# EAGLE board eTapper1main31 (EAGLE 8.3.2)
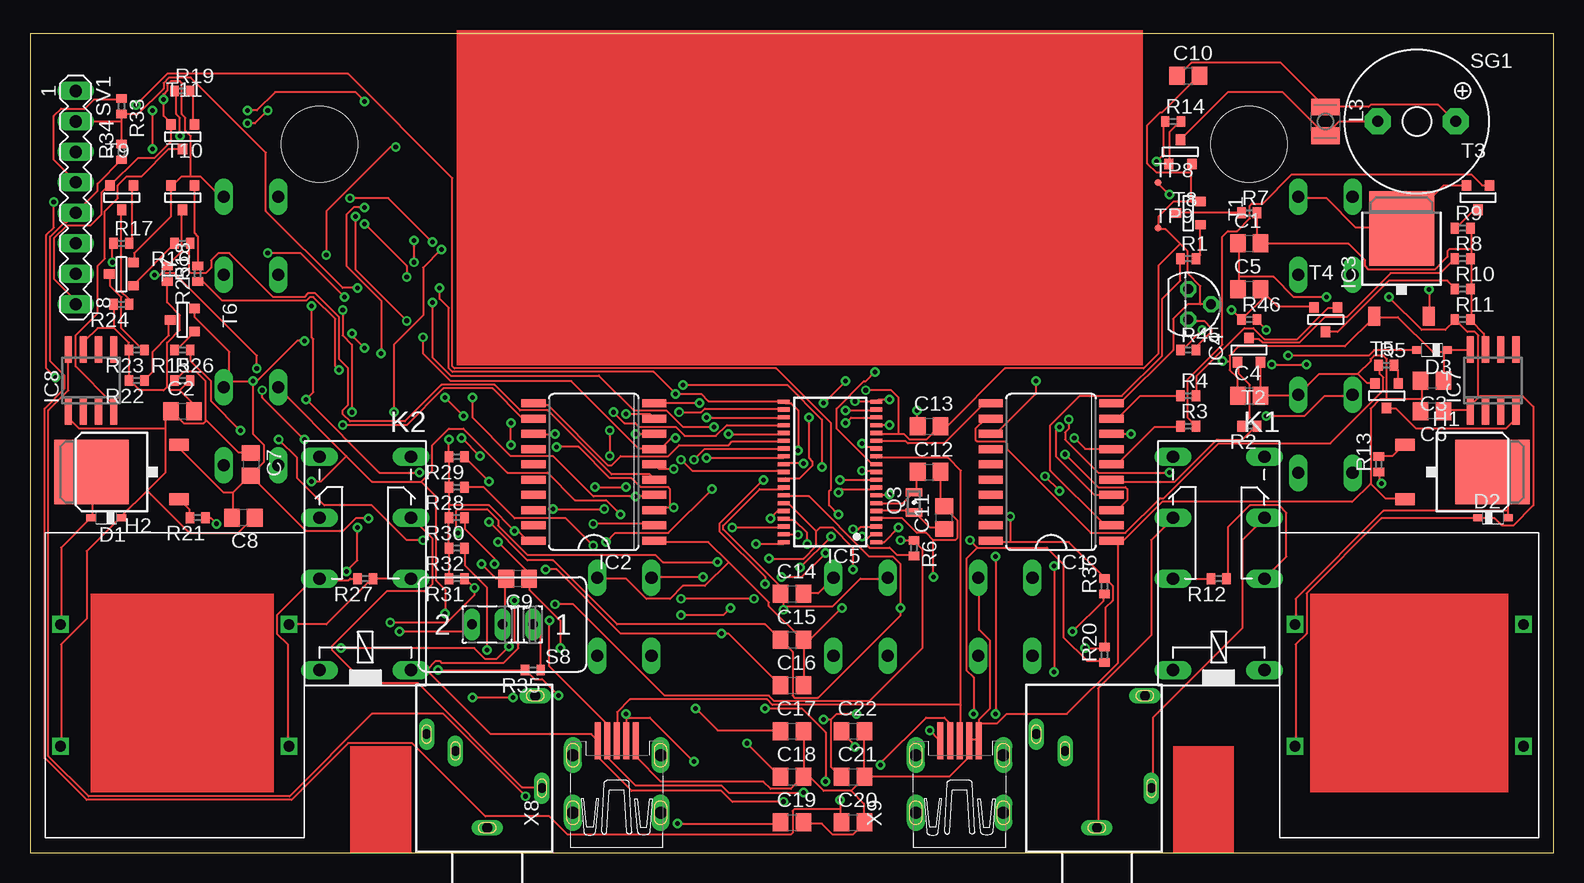
[diagram p1: board, top side]
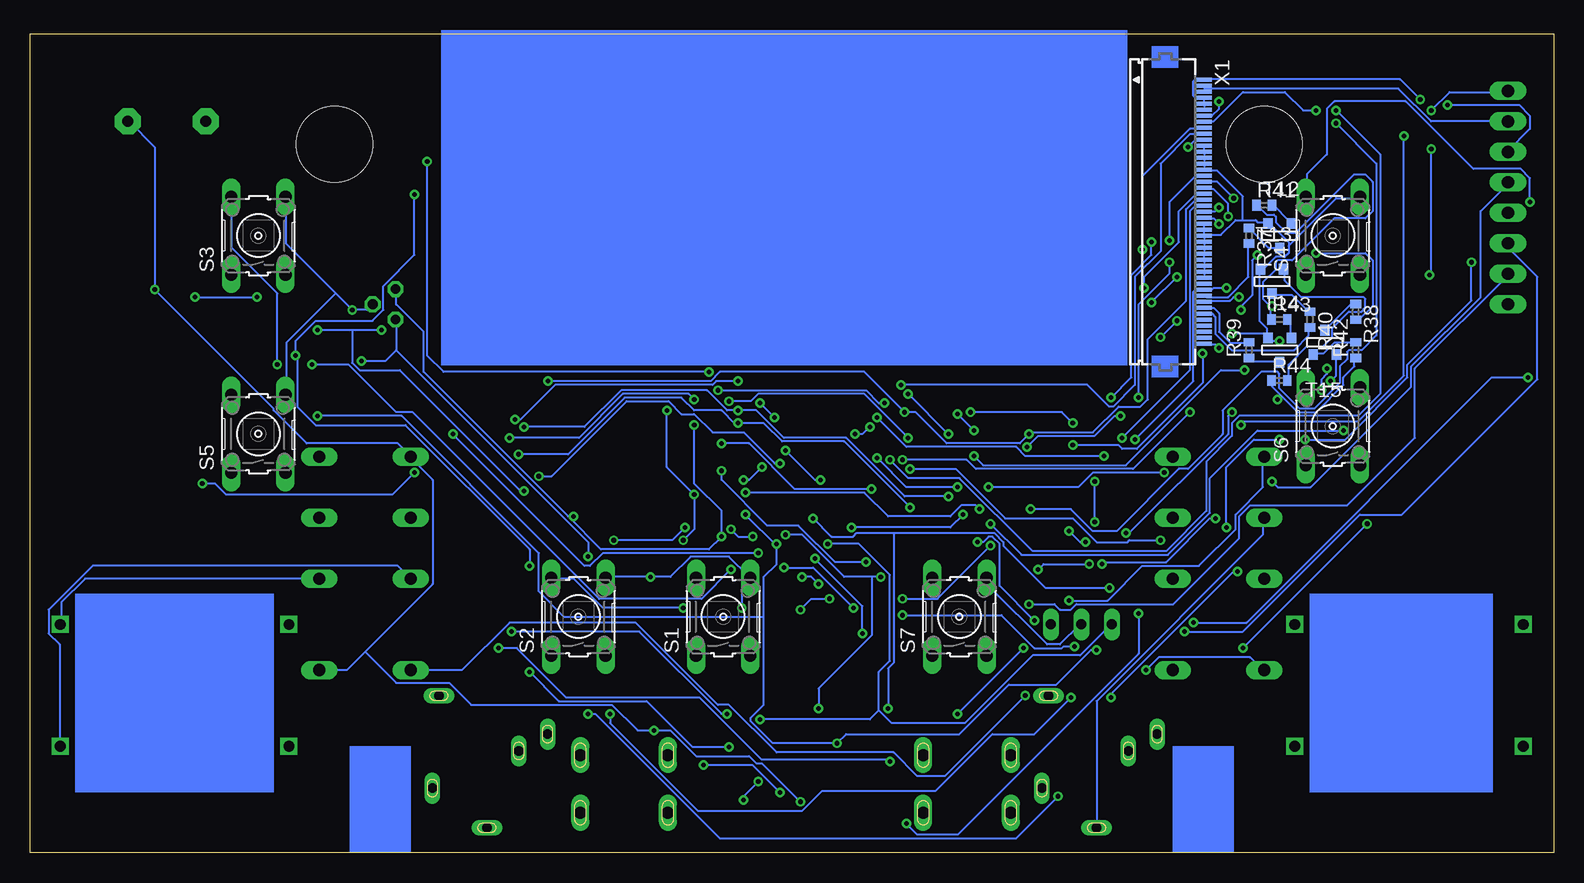
[diagram p2: board, bottom side, seen from below]

Size 126.98 x 68.25 mm. Coordinates in mm from the lower left corner, seen from the top.
Outline: 0,0 126.98,0 126.98,68.25 0,68.25 0,0
Copper layers (1*16): Top 0.035mm / dielectric 1.5mm / Bottom 0.035mm
Design rules "default *": minimum track width 6mil, minimum drill 15mil, track to track 6mil, track to pad 6mil, pad to pad 6mil, via to via 6mil, smd to smd 6mil, copper to edge 40mil, drill to drill 6mil, minimum pad ring 10mil, minimum via ring 8mil, stop-mask expansion 4mil, vias tented up to drill 0mil, thermal gap 10mil
Holes 6.35 mm at 24.13,59.05 101.6,59.05

## Footprints (pad centres in the part's own frame; a part is rotated, then mirrored left to right if it is on the bottom)
C0805 = smd 1.3 x 1.5: 1 -0.95,0; 2 0.95,0
SOD323_ST = smd 0.8 x 0.6: A 1.25,0; C -1.25,0
XFMR = drill 0.889 square: P$1 -10.16,5.08; P$2 -10.16,-5.08; P$3 8.89,5.08; P$4 8.89,-5.08
D-PAK_TO252AA = smd 1 x 1.6: 1 -2.28,-4.8; 3 2.28,-4.8 | smd 5.4 x 6.2: 4 0,2.5
SO20W = smd 0.66 x 2.032: 1 -5.715,-5.029; 2 -4.445,-5.029; 3 -3.175,-5.029; 4 -1.905,-5.029; 5 -0.635,-5.029; 6 0.635,-5.029; 7 1.905,-5.029; 8 3.175,-5.029; 9 4.445,-5.029; 10 5.715,-5.029; 11 5.715,5.029; 12 4.445,5.029; 13 3.175,5.029; 14 1.905,5.029; 15 0.635,5.029; 16 -0.635,5.029; 17 -1.905,5.029; 18 -3.175,5.029; 19 -4.445,5.029; 20 -5.715,5.029
TO252 = smd 1 x 1.6: 1 -2.28,-4.8; 3 2.28,-4.8 | smd 5.4 x 6.2: 2 0,2.5
TO92 = drill 0.813 pad 1.27 octagon: 1 -1.27,0; 2 0,1.905; 3 1.27,0
TSSOP38_R-PDSO-G38-DA = smd 0.35 x 1: 1 -5.85,-3.85; 2 -5.2,-3.85; 3 -4.55,-3.85; 4 -3.9,-3.85; 5 -3.25,-3.85; 6 -2.6,-3.85; 7 -1.95,-3.85; 8 -1.3,-3.85; 9 -0.65,-3.85; 10 0,-3.85; 11 0.65,-3.85; 12 1.3,-3.85; 13 1.95,-3.85; 14 2.6,-3.85; 15 3.25,-3.85; 16 3.9,-3.85; 17 4.55,-3.85; 18 5.2,-3.85; 19 5.85,-3.85; 20 5.85,3.85; 21 5.2,3.85; 22 4.55,3.85; 23 3.9,3.85; 24 3.25,3.85; 25 2.6,3.85; 26 1.95,3.85; 27 1.3,3.85; 28 0.65,3.85; 29 0,3.85; 30 -0.65,3.85; 31 -1.3,3.85; 32 -1.95,3.85; 33 -2.6,3.85; 34 -3.25,3.85; 35 -3.9,3.85; 36 -4.55,3.85; 37 -5.2,3.85; 38 -5.85,3.85
SO08 = smd 0.6 x 2.2: 1 -1.905,-2.6; 2 -0.635,-2.6; 3 0.635,-2.6; 4 1.905,-2.6; 5 1.905,2.6; 6 0.635,2.6; 7 -0.635,2.6; 8 -1.905,2.6
351 = drill 1.016 long: 1 -3.81,-3.81; 16 -3.81,3.81; O1 8.89,-3.81; O2 8.89,3.81; P1 3.81,-3.81; P2 3.81,3.81; S1 13.97,-3.81; S2 13.97,3.81
L2825P = smd 1.4 x 2.4: 1 -1.2,0; 2 1.2,0
FC-12M = smd 0.7 x 1.4: 1 -0.85,0; 2 0.85,0
R0402 = smd 0.7 x 0.9: 1 -0.65,0; 2 0.65,0
B3F-10XX = drill 1.016 long: 1 -3.251,2.261; 2 3.251,2.261; 3 -3.251,-2.261; 4 3.251,-2.261
M251 = drill 0.813 long: 1 -2.54,0; 2 0,0; 3 2.54,0
F/QMBIII = drill 0.914 pad 2.159 octagon: + 3.251,0; - -3.251,0
MA08-1 = drill 1.016 long: 1 -8.89,0; 2 -6.35,0; 3 -3.81,0; 4 -1.27,0; 5 1.27,0; 6 3.81,0; 7 6.35,0; 8 8.89,0
SOT-23 = smd 0.787 x 0.889: 1 0.025,-1.016; 2 -0.94,1.016; 3 0.991,1.016
TP06R = smd 0.6 x 0.6: TP 0,0
FH12-45S-0.5SH = smd 0.3 x 1.3: 1 -13,3.25; 2 -12.5,3.25; 3 -12,3.25; 4 -11.5,3.25; 5 -11,3.25; 6 -10.5,3.25; 7 -10,3.25; 8 -9.5,3.25; 9 -9,3.25; 10 -8.5,3.25; 11 -8,3.25; 12 -7.5,3.25; 13 -7,3.25; 14 -6.5,3.25; 15 -6,3.25; 16 -5.5,3.25; 17 -5,3.25; 18 -4.5,3.25; 19 -4,3.25; 20 -3.5,3.25; 21 -3,3.25; 22 -2.5,3.25; 23 -2,3.25; 24 -1.5,3.25; 25 -1,3.25; 26 -0.5,3.25; 27 0,3.25; 28 0.5,3.25; 29 1,3.25; 30 1.5,3.25; 31 2,3.25; 32 2.5,3.25; 33 3,3.25; 34 3.5,3.25; 35 4,3.25; 36 4.5,3.25; 37 5,3.25; 38 5.5,3.25; 39 6,3.25; 40 6.5,3.25; 41 7,3.25; 42 7.5,3.25; 43 8,3.25; 44 8.5,3.25; 45 9,3.25
1503_09 = drill 0.8 pad 1.2 long: 1 0,-2.1; 2 -4.55,-5.4; 3 5.05,-9.9; 4 -4,-13.1; 5 2.65,-8.5
32005-501 = smd 3.1 x 0.5: 1 3,1.6; 2 3,0.8; 3 3,0; 4 3,-0.8; 5 3,-1.6 | drill 1 pad 1.422 long: M1 -3,3.65; M2 -3,-3.65; M3 1.8,3.65; M4 1.8,-3.65

## Placement (x,y rotation side)
C1  .01uF  [C0805]  101.6,50.8 0 top
C2  .01uF  [C0805]  12.7,36.83 0 top
C3  [C0805]  116.84,39.37 180 top
C4  [C0805]  101.6,38.1 0 top
C5  3.3uF  [C0805]  101.6,46.99 0 top
C6  220uF  [C0805]  116.84,36.83 180 top
C7  220uF  [C0805]  18.41,32.38 270 top
C8  3.3uF  [C0805]  17.78,27.94 180 top
C9  47uF  [C0805]  40.64,22.86 180 top
C10  47uF  [C0805]  96.52,64.77 0 top
C11  12pF  [C0805]  76.2,27.94 90 top
C12  12pF  [C0805]  74.93,31.75 0 top
C13  1 uF  [C0805]  74.93,35.56 0 top
C14  .1uF  [C0805]  63.5,21.59 0 top
C15  .1uF  [C0805]  63.5,17.78 0 top
C16  .1uF  [C0805]  63.5,13.97 0 top
C17  .1uF  [C0805]  63.5,10.16 0 top
C18  .1uF  [C0805]  63.5,6.35 0 top
C19  .1uF  [C0805]  63.5,2.54 0 top
C20  .1uF  [C0805]  68.58,2.54 0 top
C21  .1uF  [C0805]  68.58,6.35 0 top
C22  220uF  [C0805]  68.58,10.16 0 top
D1  BAT60J  [SOD323_ST]  6.35,27.94 180 top
D2  BAT60J  [SOD323_ST]  121.92,27.94 0 top
D3  BAT60J  [SOD323_ST]  116.84,41.91 180 top
F1  XFMR  [XFMR]  115.57,13.97 0 top
F2  XFMR  [XFMR]  12.7,13.97 0 top
H1  IRLR024N  [D-PAK_TO252AA]  119.38,31.75 270 top
H2  IRLR024N  [D-PAK_TO252AA]  7.62,31.75 90 top
IC1  74AC373DW  [SO20W]  85.09,31.75 90 top
IC2  74AC373DW  [SO20W]  46.99,31.75 90 top
IC3  LM2936DT-5.0  [TO252]  114.3,49.53 0 top
IC4  LM2936Z-3.0  [TO92]  96.52,45.72 270 top
IC5  MSP430F2232IDA  [TSSOP38_R-PDSO-G38-DA]  66.67,31.75 90 top
IC7  LP2951M  [SO08]  121.92,39.37 0 top
IC8  LP2951M  [SO08]  5.08,39.37 0 top
K1  351  [351]  99.06,19.05 90 top
K2  351  [351]  27.94,19.05 90 top
L3  470uH  [L2825P]  107.95,60.96 270 top
Q3  FC-12M  [FC-12M]  73.66,29.21 90 top
R1  47K  [R0402]  96.52,49.53 0 top
R2  47K  [R0402]  101.6,35.56 180 top
R3  47K  [R0402]  96.52,35.56 0 top
R4  47K  [R0402]  96.52,38.1 0 top
R5  47K  [R0402]  113.03,40.64 0 top
R6  47K  [R0402]  73.66,25.4 270 top
R7  1K  [R0402]  101.6,53.34 0 top
R8  3K  [R0402]  119.38,49.53 0 top
R9  6K  [R0402]  119.38,52.07 0 top
R10  12K  [R0402]  119.38,46.99 0 top
R11  3K  [R0402]  119.38,44.45 0 top
R12  51K  [R0402]  99.06,22.86 180 top
R13  1K  [R0402]  112.39,32.38 90 top
R14  1K  [R0402]  95.25,60.96 0 top
R15  47K  [R0402]  12.7,41.91 180 top
R16  47K  [R0402]  12.7,50.8 180 top
R17  47K  [R0402]  7.62,50.8 0 top
R18  47K  [R0402]  13.97,48.26 90 top
R19  47K  [R0402]  12.7,63.5 0 top
R20  47K  [R0402]  89.53,16.51 90 top
R21  1K  [R0402]  13.97,27.94 180 top
R22  1K  [R0402]  8.89,39.37 180 top
R23  3K  [R0402]  8.89,41.91 180 top
R24  6K  [R0402]  7.62,45.72 180 top
R25  12K  [R0402]  11.43,48.26 270 top
R26  3K  [R0402]  12.7,39.37 0 top
R27  51K  [R0402]  27.94,22.86 180 top
R28  47K  [R0402]  35.56,30.48 180 top
R29  47K  [R0402]  35.56,33.02 180 top
R30  47K  [R0402]  35.56,27.94 180 top
R31  47K  [R0402]  35.56,22.86 180 top
R32  47K  [R0402]  35.56,25.4 180 top
R33  47K  [R0402]  7.62,62.23 270 top
R34  47K  [R0402]  7.62,58.42 90 top
R35  100  [R0402]  41.91,15.24 180 top
R36  47K  [R0402]  89.53,22.23 90 top
R37  100  [R0402]  25.4,51.44 270 bottom
R38  100  [R0402]  16.51,45.09 270 bottom
R39  100  [R0402]  25.4,41.91 90 bottom
R40  100  [R0402]  20.32,44.45 270 bottom
R41  47K  [R0402]  24.13,53.98 0 bottom
R42  47K  [R0402]  16.51,41.91 90 bottom
R43  47K  [R0402]  22.86,44.45 0 bottom
R44  47K  [R0402]  22.86,39.37 0 bottom
R45  47K  [R0402]  96.52,41.91 0 top
R46  10K  [R0402]  101.6,44.45 0 top
S1  [B3F-10XX]  69.22,19.68 90 bottom
S2  [B3F-10XX]  81.28,19.68 90 bottom
S3  [B3F-10XX]  107.95,51.44 90 bottom
S4  [B3F-10XX]  18.41,51.44 90 bottom
S5  [B3F-10XX]  107.95,34.92 90 bottom
S6  [B3F-10XX]  18.41,35.56 90 bottom
S7  [B3F-10XX]  49.53,19.68 90 bottom
S8  [M251]  39.37,19.05 180 top
SG1  F/QMBIII  [F/QMBIII]  115.57,60.96 0 top
SV1  [MA08-1]  3.81,54.61 270 top
T1  2N3904  [SOT-23]  96.52,53.34 270 top
T2  2N3904  [SOT-23]  101.6,41.91 180 top
T3  2N3904  [SOT-23]  120.65,54.61 0 top
T4  2N3904  [SOT-23]  107.95,44.45 0 top
T5  2N3904  [SOT-23]  113.03,38.1 0 top
T6  2N3904  [SOT-23]  12.7,44.45 270 top
T7  2N3904  [SOT-23]  7.62,48.26 270 top
T8  2N3904  [SOT-23]  95.89,58.42 180 top
T9  2N3904  [SOT-23]  7.62,54.61 0 top
T10  2N3904  [SOT-23]  12.7,54.61 0 top
T11  2N3904  [SOT-23]  12.7,59.69 0 top
T12  2N3904  [SOT-23]  22.86,51.44 0 bottom
T13  2N3904  [SOT-23]  23.5,47.62 0 bottom
T14  2N3904  [SOT-23]  22.86,41.91 0 bottom
T15  2N3904  [SOT-23]  19.05,42.55 180 bottom
TP8  TPSTP06R  [TP06R]  93.98,55.88 0 top
TP9  TPSTP06R  [TP06R]  93.98,52.07 0 top
X1  FH12-45S-0.5SH  [FH12-45S-0.5SH]  32.38,51.44 270 bottom
X6  1503_09  [1503_09]  88.9,0 180 top
X7  1503_09  [1503_09]  38.1,0 180 top
X8  MINI-USB_SHIELD5P4-32005-501  [32005-501]  48.9,6.35 90 top
X9  MINI-USB_SHIELD5P4-32005-501  [32005-501]  77.47,6.35 90 top

## Tracks (layer width: path | path; a pad name or v marks a point on that pad's centre or on a via)
+3V  (via drill 0.38)
  Top 0.152: 81.69,25.91 86.56,25.91 89.46,23.01 R36.2 89.61,22.86 90.22,22.25 90.22,21.03 89.61,20.42 89.61,17.22 R20.2 89.46,17.07 v87.94,17.07 | 81.69,25.91 80.16,25.91 IC1.20 | 69.65,26.06 69.65,25.76 69.95,25.45 71.63,25.45 72.24,24.84 73.61,24.84 R6.2 | 69.65,26.06 70.1,26.52 70.41,26.52 IC5.2 | v71.63,35.66 70.56,35.66 IC5.16 | 69.65,26.06 v69.34,26.36 | v81.69,28.04 81.69,25.91 | R33.2 7.62,60.96 | 7.62,60.96 R34.2 | SV1.2 7.62,60.96 | R31.2 34.9,25.3 R32.2 34.9,25.45 34.9,27.89 R30.2 34.9,28.04 34.9,28.96 | R28.2 34.9,32.92 R29.2 34.9,33.07 v34.9,34.44 | R28.2 34.9,28.96 | R28.2 | v39.01,25.91 41.45,23.47 41.45,22.86 C9.1 41.6,22.86 41.6,21.95 44.2,19.36 v44.2,17.07 | IC2.20 41.91,26.06 41.45,26.06 40.69,26.82 v40.39,26.82 38.25,28.96 34.9,28.96 | 49.68,11.28 49.68,9.45 X8.4 | R33.2 8.99,61.57 11.12,63.7 11.12,64.16 11.58,64.62 13.41,64.62 19.66,58.37 19.66,53.49 26.06,47.09 v27.28,47.09 | R33.2 | v55.32,7.62 51.66,11.28 49.68,11.28 | 49.68,11.28 v49.68,11.58
  Bottom 0.152: v71.63,35.66 71.63,30.79 69.34,28.5 v69.34,26.36 70.41,25.3 79.4,25.3 82.14,28.04 | 82.14,28.04 94.18,40.08 94.18,43.43 96.47,45.72 96.47,46.94 IC4.1 | 82.14,28.04 v81.69,28.04 | 29.11,63.7 29.11,63.86 X1.2 | 29.11,63.7 29.11,63.55 X1.3 | 29.11,63.7 12.95,63.7 10.21,60.96 SV1.2 | v34.9,34.44 30.02,39.32 30.02,46.79 29.87,46.94 29.26,46.94 X1.36 29.11,46.94 28.5,46.94 28.35,47.09 v27.28,47.09 | v39.01,25.91 39.47,25.91 v40.39,26.82 | v44.2,17.07 v49.68,11.58 | v87.94,17.07 86.41,17.07 82.3,12.95 71.17,12.95 65.99,7.77 55.47,7.77 v55.32,7.62
+9V  (via drill 0.38)
  Top 0.152: D3.C 119.94,41.91 IC7.8 | 117.81,41.76 117.81,39.47 C3.1 | 117.81,41.76 117.96,41.91 D3.C | 99.97,41 99.97,41.45 100.74,42.22 109.58,42.22 112.01,44.65 IC3.1 112.17,44.65 114,44.65 116.89,41.76 117.81,41.76 | 99.97,41 99.97,40.23 100.58,39.62 100.58,38.1 C4.1 | 117.81,41.76 D3.C | R45.2 97.23,41.91 97.23,42.22 98.45,43.43 98.45,43.74 97.84,44.35 96.62,44.35 IC4.3 | v41.3,4.72 34.44,11.58 28.5,11.58 21.64,4.72 4.88,4.72 1.52,8.08 1.52,36.88 3.2,38.56 3.2,41.91 IC8.8 | v80.47,24.69 v80.47,11.58 | v99.36,41 99.97,41
  Bottom 0.152: v41.3,4.72 44.81,1.22 69.49,1.22 79.86,11.58 v80.47,11.58 | v80.47,24.69 80.47,25.91 96.47,41.91 | 96.47,41.91 96.47,44.35 IC4.3 | v99.36,41 97.38,41 96.47,41.91
/LCS  (via drill 0.38)
  Top 0.152: v67.36,30.02 67.67,30.33 70.41,30.33 IC5.8 | v43.59,28.65 v47.85,28.65 | v18.14,60.81 18.75,60.81 v19.81,61.87
  Bottom 0.152: v67.36,30.02 57.45,30.02 55.47,28.04 50.29,28.04 49.38,28.96 48.16,28.96 v47.85,28.65 | v43.59,28.65 40.23,28.65 38.41,26.82 36.42,26.82 31.24,32 30.48,32 27.58,34.9 27.58,36.88 24.38,40.08 23.01,40.08 22.86,39.93 22.86,38.71 21.18,37.03 19.96,37.03 17.83,39.17 17.83,40.54 17.22,41.15 17.22,41.76 17.07,41.91 16,41.91 14.78,43.13 14.78,57.45 v18.14,60.81 | v19.81,61.87 20.88,61.87 22.4,63.4 25.91,63.4 28.35,60.96 29.11,60.96 X1.8
/RST  (via drill 0.38)
  Top 0.152: v72.54,26.06 73.61,26.06 R6.1 73.76,25.91 74.37,25.3 74.37,17.07 69.95,12.65 62.03,12.65 61.57,13.11 52.88,13.11 45.26,20.73 v43.74,20.73 | v71.63,29.87 70.56,29.87 IC5.7 | v73.91,36.88 73.91,35.66 C13.1
  Bottom 0.152: v72.54,26.06 71.63,26.98 v71.63,29.87 73.91,32.16 v73.91,36.88 | v43.74,20.73 41.6,20.73 41.15,20.27 40.23,20.27 39.78,20.73 31.7,20.73 26.21,26.21 26.21,28.04 25.3,28.96 17.22,28.96 11.58,34.59 11.58,40.39 3.81,48.16 SV1.7
BAT+  (via drill 0.38)
  Top 0.152: v94.94,54.86 94.03,55.78 TP8.TP | v104.85,41.45 111.56,41.45 112.01,41.91 D3.A | v68.73,8.84 68.73,8.99 67.67,10.06 C22.1 | v85.34,23.93 v85.34,15.09
  Bottom 0.152: v94.94,54.86 94.94,49.84 97.54,47.24 97.54,45.26 98.45,44.35 103.17,44.35 104.85,42.67 v104.85,41.45 104.7,41.3 104.7,37.19 103.17,35.66 95.71,35.66 85.34,25.3 v85.34,23.93 | v68.73,8.84 71.78,8.84 75.59,12.65 82.91,12.65 v85.34,15.09
GND  (via drill 0.38)
  Top 0.152: 102.56,38.1 102.56,40.84 T2.2 | 110.64,39.93 111.4,39.17 112.01,39.17 T5.2 | 110.64,39.93 107.44,39.93 S5.4 105.61,38.1 102.56,38.1 | 102.56,38.1 C4.2 | 115.98,37.8 115.98,39.32 C3.2 | 115.98,37.8 115.98,36.88 C6.2 | 111.71,30.79 112.93,29.57 114.45,29.57 H1.3 | 111.71,30.79 111.71,37.03 112.47,37.8 113.08,37.8 | 115.98,37.8 113.08,37.8 | 90.68,26.06 91.14,26.06 94.34,29.26 110.19,29.26 111.71,30.79 | 90.68,26.06 90.22,26.06 IC1.1 90.68,26.06 | 110.64,39.93 111.71,41 111.71,41.15 112.01,41.45 112.78,41.45 113.08,41.15 113.08,37.8 | 72.39,34.9 72.85,34.9 73.3,34.44 74.68,34.44 75.74,35.51 C13.2 75.89,35.66 76.5,35.66 81.23,40.39 92.81,40.39 94.03,41.6 94.03,48.92 95.86,50.75 | 72.39,34.9 70.56,34.9 IC5.15 | v55.78,37.49 52.12,37.49 IC2.10 | v69.65,38.56 71.78,38.56 72.39,37.95 72.39,34.9 | T3.2 117.81,55.63 114.3,52.12 | 114.3,52.12 110.49,52.12 108.05,54.56 105.77,54.56 S3.4 | 114.3,52.12 IC3.2 | 96.77,54.25 97.54,54.25 T1.2 | 96.77,54.25 95.25,54.25 94.03,53.03 94.03,52.12 TP9.TP 94.03,51.97 94.64,51.97 95.86,50.75 | 96.77,54.25 96.77,56.69 | 96.77,56.69 96.77,57.3 T8.2 | 96.77,56.69 93.88,56.69 93.12,57.45 93.12,60.66 94.18,61.72 94.34,61.72 97.38,64.77 C10.2 | 103.02,46.48 102.56,46.94 C5.2 103.02,46.48 | 103.02,46.48 103.94,45.57 106.98,45.57 T4.2 | 103.02,46.48 101.04,44.5 R46.1 100.89,44.5 v100.13,45.26 | IC4.2 97.54,45.72 | 97.54,45.72 96.47,45.72 95.25,44.5 95.25,41.91 90.83,37.49 90.22,37.49 IC1.10 | 95.86,50.75 96.47,50.14 96.47,48.31 97.54,47.24 97.54,45.72 | SV1.8 3.81,46.02 1.98,47.85 1.98,51.21 3.05,52.27 5.03,52.27 5.94,53.19 5.94,55.02 6.55,55.63 T9.2 6.71,55.63 8.99,57.91 10.36,57.91 11.73,59.28 11.73,60.66 T11.2 11.73,60.81 11.12,61.42 v11.12,62.79 11.12,63.25 11.43,63.55 11.43,64.01 11.73,64.31 12.5,64.31 12.65,64.16 12.65,61.57 12.95,61.27 12.95,60.2 13.41,59.74 13.41,56.39
  Top 0.152: 16.61,39.32 v18.59,39.32 | 16.61,39.32 16.15,38.86 S6.4 16.61,39.32 | T6.2 13.72,44.65 16.61,41.76 16.61,39.32 | 16.92,30.02 16.92,28.04 C8.2 | 16.92,30.02 18.29,31.39 C7.2 | 16.92,30.02 16.15,30.02 12.5,33.68 12.5,33.98 H2.3 | v18.59,39.32 18.59,34.9 19.51,33.98 19.51,32.61 18.44,31.55 C7.2 | T7.2 8.69,49.23 8.69,49.99 11.73,53.03 11.73,55.63 T10.2 11.89,55.63 12.65,56.39 13.41,56.39 | 13.41,56.39 14.17,56.39 15.85,54.71 16.15,54.71 S4.4 | v27.89,42.06 26.82,43.13 v26.82,43.28 | v18.59,39.32 18.9,39.32 22.25,42.67 v22.86,42.67 | 39.62,22.86 39.62,19.2 39.47,19.05 S8.2 | C16.2 64.47,14.02 64.47,17.68 C15.2 | 58.22,24.23 61.57,20.88 61.57,20.57 64.31,17.83 C15.2 | 58.22,24.23 56.54,25.91 52.12,25.91 IC2.1 | 58.22,24.23 56.24,22.25 54.41,22.25 53.34,21.18 51.36,21.18 49.68,22.86 47.4,22.86 S7.4 | 75.29,26.06 74.68,26.67 73.91,26.67 72.69,27.89 70.56,27.89 IC5.4 | 75.29,26.06 77.11,26.06 77.27,26.21 77.27,27.74 76.2,28.8 C11.2 76.2,28.96 75.89,29.26 75.89,31.7 C12.2 | C14.2 64.47,21.64 65.68,21.64 66.9,22.86 S1.4 | v75.29,23.01 75.29,26.06 | X9.5 78.94,9.45 78.33,9.45 X9.4 78.18,9.3 78.18,7.92 76.66,6.4 69.65,6.4 C21.2 | C19.2 64.47,2.44 65.99,2.44 66.9,1.52 68.58,1.52 69.49,2.44 C20.2 69.49,2.59 69.49,4.12 68.43,5.18 | C18.2 64.47,6.4 64.47,10.06 C17.2 | C21.2 69.49,6.4 69.49,10.06 C22.2 | 68.43,5.18 66.14,5.18 65.08,6.25 64.47,6.25 C18.2 | 68.43,5.18 69.49,6.25 C21.2 | X8.5 50.6,9.3 50.6,7.92 52.58,5.94 61.11,5.94 61.72,5.33 63.4,5.33 64.31,6.25 C18.2 | 79.1,10.82 79.1,9.45 X9.5 | 79.1,10.82 79.1,11.12 80.01,12.04 80.01,17.68 79.1,18.59 79.1,22.86 S2.4 | v67.67,20.42 65.08,17.83 64.47,17.83 C15.2
  Top 0.152: v28.19,27.89 27.13,27.89 26.06,26.82 23.01,26.82 18.44,31.39 C7.2 | v37.64,24.08 38.86,22.86 39.62,22.86 | 39.62,22.86 C9.2 | 90.68,26.06 90.68,15.85 86.41,11.58 81.38,11.58 80.62,10.82 79.1,10.82 | 79.1,10.82 X9.5
  Bottom 0.152: v55.78,37.49 56.24,37.49 57.3,38.56 v69.65,38.56 | IC4.2 98.45,45.72 98.91,45.26 v100.13,45.26 101.5,46.63 | 101.5,46.63 105.61,50.75 105.61,54.56 S3.4 | 101.5,46.63 105.61,42.52 105.61,38.25 S5.4 | X1.6 29.11,62.03 29.11,62.33 X1.5 29.11,62.48 29.11,62.79 X1.4 29.26,62.94 29.87,62.94 30.02,63.09 30.02,64.31 29.87,64.47 29.26,64.47 X1.1 29.11,64.47 12.8,64.47 v11.12,62.79 | v18.59,39.32 18.14,39.78 18.14,41.45 T15.2 | 23.93,43.28 23.93,43.74 24.54,44.35 24.54,48.62 T13.2 24.38,48.77 24.08,48.77 23.16,49.68 22.4,49.68 22.1,49.99 22.1,50.6 | 23.93,43.28 23.93,42.98 T14.2 | v27.89,42.06 28.19,42.37 29.11,42.37 X1.45 | 23.93,43.28 v26.82,43.28 | 23.93,43.28 T14.2 | X1.34 29.11,48.01 29.11,48.31 X1.33 29.11,48.46 29.11,48.92 X1.32 29.11,49.07 29.11,49.38 X1.31 29.11,49.53 29.11,49.84 X1.30 29.11,49.99 29.11,50.29 X1.29 29.11,50.44 29.11,50.9 X1.28 29.11,51.05 29.11,51.36 X1.27 29.11,51.51 | X1.12 29.11,58.83 29.11,58.52 X1.13 29.11,58.37 29.11,58.06 X1.14 29.11,57.91 29.11,57.45 X1.15 29.11,57.3 29.11,57 X1.16 29.11,56.84 28.04,56.84 25.91,54.71 25.91,52.73 | 25.91,52.73 26.52,52.73 27.74,51.51 29.11,51.51 | 25.91,52.73 24.84,52.73 24.69,52.58 23.93,52.58 T12.2 23.77,52.58 22.1,50.9 22.1,50.6 | 29.11,51.51 29.11,51.82 X1.26 29.11,51.97 29.11,52.43 X1.25 | 22.1,50.6 18.14,54.56 16.15,54.56 S4.4 | v22.86,42.67 23.62,42.67 23.77,42.82 T14.2 | S7.4 47.24,22.86 47.24,22.4 42.22,17.37 41.15,17.37 39.47,19.05 S8.2 | S2.4 78.94,23.01 v75.29,23.01 73.61,23.01 71.93,24.69 68.73,24.69 67.06,23.01 S1.4 67.06,22.86 67.67,22.25 v67.67,20.42 | v28.19,27.89 28.65,27.89 32.31,24.23 37.49,24.23 v37.64,24.08
IO1_0  (via drill 0.38)
  Top 0.152: R28.1 37.8,30.48 40.39,27.89 44.65,27.89 v46.94,25.6 | v60.35,21.18 v54.25,21.18 | 62.79,20.57 62.79,21.34 62.64,21.49 C14.1 62.48,21.64 62.48,22.25 57.76,26.98 57.76,27.28 60.81,30.33 62.79,30.33 IC5.31 | 62.79,20.57 66.9,20.57 69.19,22.86 71.48,22.86 S1.2 | 62.79,20.57 v62.79,20.27
  Bottom 0.152: v46.94,25.6 51.36,21.18 v54.25,21.18 | v60.35,21.18 61.87,21.18 v62.79,20.27
IO1_1  (via drill 0.38)
  Top 0.152: v38.25,30.94 36.27,32.92 R29.1 | v38.25,27.58 41.45,24.38 43.59,24.38 48.92,19.05 61.27,19.05 62.48,17.83 C15.1 62.64,17.68 63.55,16.76 63.55,13.11 63.7,12.95 65.68,12.95 72.54,19.81 v72.54,20.42 72.54,24.08 71.93,24.69 69.95,24.69 64.92,29.72 62.94,29.72 IC5.32
  Bottom 0.152: v38.25,27.58 v38.25,30.94 | v72.54,20.42 79.25,20.42 81.69,22.86 83.52,22.86 S2.2
IO1_2  (via drill 0.38)
  Top 0.152: v38.71,24.08 38.71,24.54 36.27,26.98 36.27,27.89 R30.1 | v42.98,23.62 43.89,23.62 49.23,18.29 v57.61,18.29 58.22,18.29 62.48,14.02 C16.1 | 65.53,26.82 63.25,29.11 62.94,29.11 IC5.33 | 65.53,26.82 65.53,25.6 64.47,24.54 v61.57,24.54 | v103.48,40.69 v106.38,40.69 | v68.58,23.62 68.58,25.45 66.9,27.13 65.84,27.13 65.53,26.82
  Bottom 0.152: v38.71,24.08 42.52,24.08 v42.98,23.62 | v61.57,24.54 57.61,20.57 v57.61,18.29 | v106.38,40.69 106.38,46.63 110.19,50.44 110.19,54.56 S3.2 | v103.48,40.69 100.43,40.69 96.47,36.73 95.1,36.73 79.55,21.18 71.02,21.18 v68.58,23.62
IO1_3  (via drill 0.38)
  Top 0.152: v61.72,27.89 62.33,28.5 62.79,28.5 IC5.34 | R31.1 36.27,22.86 v37.03,22.1 37.03,21.49 34.75,19.2 v30.02,19.2 | v55.47,12.04 57.3,10.21 62.48,10.21 C17.1 | v1.98,54.25 1.98,52.12 1.37,51.51 1.37,40.39 v2.13,39.62
  Bottom 0.152: v37.03,22.1 42.37,22.1 45.87,25.6 45.87,25.91 46.63,26.67 55.02,26.67 | 55.02,26.67 58.06,26.67 58.37,26.36 60.2,26.36 v61.72,27.89 | v55.47,12.04 55.47,15.39 55.02,15.85 55.02,26.67 | v1.98,54.25 1.98,56.24 2.74,57 6.71,57 12.34,62.64 18.29,62.64 18.9,62.03 18.9,58.22 20.57,56.54 20.57,54.71 S4.2 | v2.13,39.62 5.18,39.62 25.6,19.2 v30.02,19.2
IO4_0  (via drill 0.38)
  Top 0.152: v67.97,35.81 68.43,36.27 70.41,36.27 IC5.17 | 53.34,28.8 52.27,28.8 52.12,28.65 IC2.3 | v32,49.23 v32,51.05 | v36.12,36.42 v34.59,37.95 | v43.89,33.83 45.72,33.83 48.31,31.24 50.14,31.24 50.9,30.48 53.19,30.48 53.34,30.33 53.34,28.8 | 53.34,28.8 v53.65,28.8 | v86.26,33.22 89,30.48 91.29,30.48 91.44,30.33 91.44,29.41 90.68,28.65 90.22,28.65 IC1.3
  Bottom 0.152: v53.65,28.8 59.13,34.29 64.31,34.29 65.84,35.81 v67.97,35.81 68.28,35.81 69.34,36.88 71.63,36.88 72.69,37.95 77.42,37.95 82.14,33.22 v86.26,33.22 | v32,51.05 32,54.25 29.87,56.39 29.26,56.39 X1.17 | v32,49.23 32,48.31 34.59,45.72 v34.59,37.95 | v36.12,36.42 36.58,36.42 38.25,34.75 42.98,34.75 v43.89,33.83
IO4_1  (via drill 0.38)
  Top 0.152: v67.97,36.88 70.41,36.88 IC5.18 | IC2.4 51.97,29.72 v50.44,29.72 46.94,29.72 43.59,33.07 40.08,33.07 36.88,36.27 v36.88,37.95 | v26.67,54.56 29.87,54.56 v33.53,50.9 | v85.8,35.51 85.5,35.2 85.5,33.07 88.7,29.87 90.07,29.87 IC1.4
  Bottom 0.152: v50.44,29.72 54.1,29.72 58.98,34.59 64.16,34.59 66.45,36.88 v67.97,36.88 68.89,36.88 70.56,38.56 77.72,38.56 80.77,35.51 v85.8,35.51 | v26.67,54.56 28.04,55.93 29.11,55.93 X1.18 | v33.53,50.9 33.53,49.84 35.2,48.16 35.2,39.62 v36.88,37.95
IO4_2  (via drill 0.38)
  Top 0.152: v68.73,37.64 70.41,37.64 IC5.19 70.56,37.64 70.71,37.8 v71.63,37.8 | v53.8,34.59 53.49,34.59 52.58,33.68 52.12,33.68 IC2.7 51.97,33.68 50.75,33.68 45.11,39.32 35.05,39.32 32.77,41.6 v32.77,42.98 | v27.13,53.03 27.13,48.62 v31.39,44.35 | v87.02,34.59 87.94,33.68 90.07,33.68 IC1.7
  Bottom 0.152: v68.73,37.64 66.9,37.64 66.29,38.25 57.45,38.25 v53.8,34.59 | v27.13,53.03 27.13,54.1 28.35,55.32 29.11,55.32 X1.19 | v32.77,42.98 v31.39,44.35 | v87.02,34.59 81.23,34.59 77.57,38.25 72.08,38.25 v71.63,37.8
IO4_3  (via drill 0.38)
  Top 0.152: v50.44,34.9 51.97,34.9 IC2.8 | v34.14,47.09 34.14,46.18 34.9,45.41 34.9,40.39 35.2,40.08 51.97,40.08 v53.8,38.25 55.93,38.25 56.54,37.64 62.79,37.64 IC5.20 62.94,37.49 63.4,37.49 64.01,36.88 v64.01,33.53 | v91.75,34.9 90.22,34.9 IC1.8 | v66.29,24.99 64.31,23.01 v62.64,23.01 | v61.27,22.4 61.27,23.01 57.45,26.82 57.45,27.43 v61.11,31.09
  Bottom 0.152: v50.44,34.9 v53.8,38.25 | v34.14,47.09 34.14,48.01 31.24,50.9 31.24,53.49 29.87,54.86 29.26,54.86 X1.20 | v91.75,34.9 80.77,23.93 80.31,23.93 79.25,24.99 v66.29,24.99 | v62.64,23.01 61.87,23.01 v61.27,22.4 | v61.11,31.09 61.57,31.09 v64.01,33.53
IO4_4  (via drill 0.38)
  Top 0.152: v54.1,36.73 55.93,36.73 56.24,37.03 62.79,37.03 IC5.21 | v43.74,34.9 42.06,34.9 IC2.13 | v83.82,39.32 83.82,38.25 80.62,35.05 80.16,35.05 IC1.13
  Bottom 0.152: X1.21 29.26,54.41 29.87,54.41 30.63,53.65 30.63,46.02 33.83,42.82 33.83,37.8 34.44,37.19 36.27,37.19 38.41,35.05 43.59,35.05 v43.74,34.9 44.5,34.14 50.6,34.14 53.19,36.73 v54.1,36.73 57.45,40.08 69.49,40.08 70.26,39.32 v83.82,39.32
IO4_5  (via drill 0.38)
  Top 0.152: v56.39,36.27 62.79,36.27 IC5.22 | v35.97,34.59 v37.49,33.07
  Bottom 0.152: v56.39,36.27 53.95,33.83 44.81,33.83 44.04,33.07 v37.49,33.07 | v35.97,34.59 30.33,40.23 30.33,53.49 29.87,53.95 29.26,53.95 X1.22
IO4_6  (via drill 0.38)
  Top 0.152: v48.62,36.73 49.53,35.81 50.44,35.81 50.75,35.51 53.8,35.51 54.56,34.75 57.15,34.75 58.06,35.66 62.79,35.66 IC5.23 | v40.08,33.98 v40.08,35.81 | v29.26,41.6 29.26,46.02 26.36,48.92 26.36,53.19 26.98,53.8 v27.89,53.8
  Bottom 0.152: v48.62,36.73 41,36.73 v40.08,35.81 | v40.08,33.98 36.27,33.98 35.97,33.68 34.75,33.68 29.26,39.17 v29.26,41.6 | v27.89,53.8 28.19,53.49 29.11,53.49 X1.23
IO4_7  (via drill 0.38)
  Top 0.152: v58.22,34.9 62.79,34.9 IC5.24 | v57,35.51 54.41,35.51 53.03,36.88 50.29,36.88 47.4,39.78 35.05,39.78 33.53,41.3 v33.53,45.87 | v31.39,48.01 31.39,48.92 v27.89,52.43
  Bottom 0.152: v58.22,34.9 57.61,34.9 v57,35.51 | v31.39,48.01 v33.53,45.87 | v27.89,52.43 28.35,52.88 29.11,52.88 X1.24
J2_1
  Top 0.152: K1.P1 104.7,24.69 104.7,28.35 104.09,28.96 101.65,28.96 99.82,27.13 99.82,22.86 R12.1
  Bottom 0.152: K1.P1 122.38,22.86 124.36,20.88 124.36,19.05 F1.P$3
J2_3
  Top 0.152: K1.P2 R12.2
  Bottom 0.152: K1.P2 96.32,23.93 121.77,23.93 125.42,20.27 125.42,18.29 124.51,17.37 124.51,8.99 F1.P$4
J3_1
  Top 0.152: K2.P1 R27.1 28.5,22.86 24.69,19.05 F2.P$3
J3_3
  Top 0.152: R27.2 26.67,22.86 26.52,22.71 24.38,22.71 24.23,22.86 K2.P2 23.62,22.86 20.57,19.81 20.57,18.29 21.49,17.37 21.49,8.99 F2.P$4
LD_/C  (via drill 0.38)
  Top 0.152: v54.25,32.77 55.17,31.85 62.79,31.85 IC5.29 | v30.33,36.73 30.33,42.37 32.77,44.81 32.77,48.77 v34.29,50.29
  Bottom 0.152: v54.25,32.77 48.92,32.77 48.16,32 35.05,32 v30.33,36.73 | v34.29,50.29 34.29,56.39 30.33,60.35 29.26,60.35 X1.9
LEDK1
  Bottom 0.152: R37.2 25.45,50.75 25.45,48.01 27.13,46.33 28.96,46.33 29.11,46.48 X1.37
LEDK2  (via drill 0.38)
  Top 0.152: v19.81,49.99 22.55,49.99 v26.21,46.33
  Bottom 0.152: v19.81,49.99 15.7,49.99 15.09,49.38 15.09,45.57 16.15,44.5 16.46,44.5 R38.2 | v26.21,46.33 26.67,46.33 26.98,46.02 29.11,46.02 X1.38
LEDK3
  Bottom 0.152: R39.2 25.45,42.52 26.98,42.52 27.89,43.43 27.89,44.96 28.35,45.41 29.11,45.41 X1.39
LEDK4
  Bottom 0.152: R40.2 20.42,43.74 20.42,43.13 21.64,41.91 26.82,41.91 28.19,43.28 28.19,44.65 28.5,44.96 29.11,44.96 X1.40
LHVTRIG  (via drill 0.38)
  Top 0.152: v112.62,30.79 112.47,30.94 112.47,31.7 R13.1 | v94.94,31.7 89,31.7 86.26,34.44 86.26,35.05 86.56,35.36 v86.56,36.12 | v66.14,37.49 v67.97,39.32 | v64.92,36.27 64.92,32.92 65.23,32.61 65.23,32.31 64.16,31.24 62.94,31.24 IC5.30
  Bottom 0.152: v112.62,30.79 111.56,30.79 110.64,29.87 96.77,29.87 v94.94,31.7 | v86.56,36.12 86.11,36.12 83.21,39.01 70.1,39.01 69.8,39.32 v67.97,39.32 | v64.92,36.27 v66.14,37.49
LLED  (via drill 0.38)
  Top 0.152: v56.39,32.92 62.79,32.92 IC5.27 | v47.09,30.48 v49.68,30.48 | v32.46,31.7 29.11,31.7 v23.01,37.8 23.62,38.41 23.62,42.82 23.47,42.98 v23.47,45.57
  Bottom 0.152: 23.62,45.57 23.62,44.5 R43.1 | 23.62,45.57 24.23,46.18 24.23,47.55 23.16,48.62 23.16,49.23 23.01,49.38 21.79,49.38 18.29,52.88 15.7,52.88 15.09,53.49 15.09,55.93 15.7,56.54 16.61,56.54 21.49,51.66 22.25,51.66 23.16,52.58 23.16,53.03 23.32,53.19 23.93,53.19 24.69,53.95 R41.1 | 22.71,38.1 23.47,38.86 23.47,39.32 R44.1 | 22.71,38.1 21.34,36.73 19.81,36.73 17.53,39.01 17.53,39.62 16.61,40.54 16.61,41.15 R42.1 | v56.39,32.92 53.95,30.48 v49.68,30.48 | v47.09,30.48 39.62,30.48 38.41,31.7 v32.46,31.7 | 22.71,38.1 v23.01,37.8 | v23.47,45.57 23.62,45.57
LRD  (via drill 0.38)
  Top 0.152: v69.34,31.85 70.41,31.85 IC5.10 | v57.3,24.23 52.73,24.23 52.12,24.84 41.45,24.84 39.01,27.28 39.01,27.74 38.1,28.65 35.66,28.65 35.51,28.5 35.51,26.82 v35.66,26.67 | v26.82,36.73 26.82,42.37 26.06,43.13 v26.06,45.26 | v24.69,49.84 24.69,53.49 30.02,58.83 v30.48,58.83
  Bottom 0.152: v69.34,31.85 69.34,31.09 65.53,27.28 62.94,27.28 59.89,24.23 v57.3,24.23 | v35.66,26.67 35.36,26.67 27.13,34.9 27.13,36.42 v26.82,36.73 | v26.06,45.26 26.06,45.57 25.15,46.48 25.15,49.38 v24.69,49.84 | v30.48,58.83 29.87,59.44 29.26,59.44 X1.11
LRESET  (via drill 0.38)
  Top 0.152: v55.32,32.77 56.24,33.68 62.79,33.68 IC5.26 | v18.14,61.87 18.9,61.87 20.42,63.4 27.13,63.4 v27.89,62.64
  Bottom 0.152: v55.32,32.77 53.8,31.24 49.53,31.24 43.43,25.15 32.31,25.15 28.96,28.5 28.96,32.61 26.82,34.75 26.82,35.81 26.21,36.42 16.31,36.42 14.48,38.25 14.48,58.22 v18.14,61.87 | v27.89,62.64 27.89,62.03 28.5,61.42 29.11,61.42 X1.7
LTS+
  Top 0.152: X6.1 89,2.13 89,13.72 93.42,18.14 93.42,26.06 95.25,27.89 K1.O2
LTS-
  Top 0.152: X6.2 93.57,5.49 93.57,11.28 101.04,18.75 101.04,26.06 102.87,27.89 K1.O1
LVSEL
  Top 0.152: IC5.14 70.56,34.29 73,34.29 73.15,34.14 76.2,34.14 79.4,37.34 80.01,37.34 IC1.11
LWR  (via drill 0.38)
  Top 0.152: v67.51,31.09 70.41,31.09 IC5.9 | v65.99,32.16 65.99,36.12 63.09,39.01 v54.41,39.01
  Bottom 0.152: v67.51,31.09 67.06,31.09 v65.99,32.16 | v54.41,39.01 38.86,39.01 37.03,37.19 36.73,37.19 34.9,39.01 34.9,48.01 32.77,50.14 32.77,57.45 30.33,59.89 29.26,59.89 X1.10
N$1
  Top 0.152: R1.1 95.86,47.7 94.34,46.18 94.34,41.45 90.98,38.1 87.48,38.1 85.04,35.66 85.04,31.85 89.46,27.43 90.07,27.43 IC1.2
N$2
  Top 0.152: R2.1 102.11,35.51 101.04,34.44 98.91,34.44 95.4,30.94 90.37,30.94 90.22,31.09 IC1.5
N$3
  Top 0.152: R3.1 95.86,35.51 93.73,35.51 90.68,32.46 90.22,32.46 IC1.6
N$4
  Top 0.152: R4.1 92.51,38.1 90.68,36.27 90.22,36.27 IC1.9
N$5
  Top 0.152: R5.1 112.47,40.54 112.47,39.93 112.78,39.62 112.78,38.56 108.36,34.14 99.06,34.14 94.49,29.57 94.18,29.57 91.29,26.67 88.39,26.67 81.38,33.68 81.38,34.14 81.23,34.29 78.94,34.29 78.79,34.44 78.79,35.36 79.55,36.12 80.01,36.12 IC1.12
N$6
  Top 0.152: T8.1 99.82,63.4 104.39,63.4 107.9,59.89 L3.2 108.05,59.89 109.12,60.96 SG1.-
N$7
  Top 0.152: T4.3 108.81,45.41 108.2,45.41 105.61,42.82 102.87,42.82 101.96,43.74 101.19,43.74 97.23,39.78 97.23,38.1 R4.2
N$8
  Top 0.152: T5.3 114,39.17 114,40.23 113.69,40.54 R5.2
N$9
  Top 0.152: 123.14,28.5 123.14,30.48 121.92,31.7 H1.4 | 123.14,28.5 123.14,28.04 D2.A | 123.14,28.5 112.78,28.5 105.46,21.18 105.46,19.05 F1.P$1
N$10
  Top 0.152: R7.1 95.56,53.34 T1.1
N$11
  Top 0.152: T2.1 101.65,42.82 102.41,42.82 102.72,42.52 105.77,42.52 107.9,44.65 109.73,44.65 113.39,48.31 117.5,48.31 R8.1
N$12
  Top 0.152: T3.1 120.55,53.49 120.24,53.49 118.87,52.12 R9.1
N$13
  Top 0.152: T1.3 97.54,49.84 97.23,49.53 R1.2
N$14
  Top 0.152: T2.3 100.74,40.84 100.74,39.93 101.65,39.01 101.65,36.27 101.04,35.66 R2.2
N$15
  Top 0.152: T3.3 121.01,55.63 120.09,56.54 105.16,56.54 102.72,54.1 101.8,54.1 101.65,53.95 101.65,52.88 100.58,51.82 99.82,51.82 99.36,51.36 99.36,42.37 96.47,39.47 96.47,36.27 97.08,35.66 R3.2
N$16
  Top 0.152: T4.1 108.97,43.43 113.23,47.7 118.11,47.7 118.72,47.09 R10.1
N$17
  Top 0.152: R7.2 102.26,51.05 102.41,50.9 C1.2 102.56,50.75 109.88,50.75 111.25,49.38 111.25,48.92 111.56,48.62 117.04,48.62 118.11,49.68 118.11,50.14 118.26,50.29 120.09,50.29 | 120.09,50.29 120.09,51.97 R9.2 | 120.09,50.29 120.09,49.53 | 120.09,49.53 120.09,47.09 R10.2 120.09,46.94 120.09,44.5 R11.2 120.09,44.35 121.16,43.28 121.16,42.06 IC7.7 | 120.09,49.53 R8.2
N$18  (via drill 0.38)
  Top 0.152: 100.74,48.01 100.74,50.75 C1.1 | 100.74,48.01 100.74,47.09 C5.1 | 120.7,37.95 120.09,37.34 120.09,36.88 IC7.1 119.94,36.88 117.81,36.88 C6.1 | 120.7,37.95 120.85,38.1 124.36,38.1 125.27,37.19 125.27,28.96 123.6,27.28 122.68,27.28 122.07,27.89 120.7,27.89 D2.C 120.55,27.89 112.62,27.89 106.38,21.64 106.38,18.29 105.46,17.37 105.46,8.99 F1.P$2 | 120.7,37.95 120.7,43.13 120.4,43.43 119.79,43.43 118.87,44.35 R11.1 118.72,44.35 117.96,43.59 115.98,43.59 v113.23,46.33 | 100.74,48.01 103.63,48.01 105.31,46.33 v108.05,46.33
  Bottom 0.152: v113.23,46.33 v108.05,46.33
N$19
  Top 0.152: H2.4 5.18,31.7 5.18,28.04 D1.A 5.03,27.89 2.59,25.45 2.59,19.05 F2.P$1
N$20  (via drill 0.38)
  Top 0.152: v17.53,35.2 15.09,37.64 15.09,39.32 13.41,41 13.41,41.91 R15.1 | v46.94,27.43 51.97,27.43 IC2.2
  Bottom 0.152: v17.53,35.2 24.69,35.2 28.65,31.24 28.65,28.35 32.16,24.84 44.35,24.84 v46.94,27.43
N$21
  Top 0.152: R13.2 112.47,33.07 113.54,33.07 114.45,33.98 H1.1
N$22
  Top 0.152: T8.3 94.94,57.45 94.94,60.05 95.86,60.96 R14.2
N$23
  Top 0.152: S8.1 42.52,18.44 42.52,15.24 R35.1
N$24
  Top 0.152: R16.1 13.26,50.75 13.26,48.46 13.41,48.31 14.63,48.31 15.09,48.77 15.09,49.38 15.7,49.99 16.61,49.99 20.27,46.33 22.86,46.33 23.16,46.63 23.77,46.63 25.76,44.65 25.76,41.15 26.52,40.39 26.52,37.34 26.06,36.88 26.06,36.58 26.67,35.97 31.24,35.97 34.29,39.01 38.71,39.01 40.84,36.88 43.13,36.88 48.46,31.55 51.66,31.55 51.97,31.24 IC2.5
N$25  (via drill 0.38)
  Top 0.152: v6.86,49.23 6.86,50.75 R17.1 | v20.73,34.44 22.25,32.92 22.25,31.24 24.54,28.96 28.5,28.96 31.39,26.06 v32.77,26.06 | v53.65,32 52.43,32 52.12,32.31 IC2.6
  Bottom 0.152: v6.86,49.23 6.86,46.02 12.19,40.69 12.19,39.62 17.37,34.44 v20.73,34.44 | v32.77,26.06 35.36,26.06 35.51,25.91 38.1,25.91 40.08,27.89 45.72,27.89 49.84,32 v53.65,32
N$26  (via drill 0.38)
  Top 0.152: v25.76,40.23 25.45,40.54 25.45,44.5 23.62,46.33 23.32,46.33 23.01,46.02 16,46.02 14.48,47.55 14.02,47.55 R18.1 | v48.31,35.2 v48.31,33.07 | v49.68,36.58 51.66,36.58 51.97,36.27 IC2.9
  Bottom 0.152: v25.76,40.23 27.74,40.23 35.66,32.31 47.55,32.31 v48.31,33.07 | v49.68,36.58 v48.31,35.2
N$27  (via drill 0.38)
  Top 0.152: v12.5,59.74 12.5,61.27 12.19,61.57 12.19,63.4 R19.1 | v26.06,35.66 31.39,35.66 34.44,38.71 38.56,38.71 41,36.27 41.91,36.27 IC2.12
  Bottom 0.152: v12.5,59.74 12.5,39.78 16.31,35.97 25.76,35.97 v26.06,35.66
N$28
  Bottom 0.152: T13.3 22.4,48.62 22.4,47.7 21.03,46.33 15.85,46.33 15.7,46.18 15.7,45.41 16,45.11 17.07,45.11 18.44,43.74 18.44,42.98 19.2,42.22 20.57,42.22 22.1,40.69 22.1,39.47 R44.2
N$29
  Top 0.152: T6.3 13.72,43.43 12.19,41.91 R15.2
N$30
  Top 0.152: T7.3 8.69,47.4 12.04,50.75 R16.2
N$31
  Top 0.152: T9.3 8.53,55.63 8.53,51.05 8.38,50.9 R17.2
N$32
  Top 0.152: T10.3 13.72,55.63 13.72,51.66 14.02,51.36 14.02,48.92 R18.2
N$33
  Top 0.152: T11.3 13.56,60.81 13.56,63.25 13.41,63.4 R19.2
N$34  (via drill 0.38)
  Top 0.152: v33.98,15.24 R35.2 41.3,15.24 42.06,14.48 42.67,14.48 v44.04,13.11
  Bottom 0.152: v33.98,15.24 32.92,16.31 25.3,16.31 24.23,15.24 K2.16 | K1.16 90.98,15.24 87.02,19.2 76.5,19.2 69.65,12.34 68.73,12.34 64.77,8.38 55.02,8.38 53.03,6.4 50.75,6.4 v44.04,13.11
N$35
  Top 0.152: T6.1 11.58,44.35 11.58,43.13 10.21,41.76 10.21,40.08 9.6,39.47 R22.1
N$36
  Top 0.152: T7.1 6.71,48.16 6.71,47.24 7.62,46.33 7.62,43.74 9.45,41.91 R23.1
N$37
  Top 0.152: T9.1 7.62,53.49 7.62,46.79 8.23,46.18 8.23,45.72 R24.1
N$38
  Top 0.152: T10.1 12.65,53.49 12.65,50.14 R25.1
N$39
  Top 0.152: R23.2 8.23,39.47 R22.2 8.38,39.32 9.14,38.56 11.12,38.56 11.43,38.86 | 7.01,43.74 7.01,45.72 R24.2 | 7.01,43.74 8.23,42.52 R23.2 | R23.2 | 7.01,43.74 5.64,43.74 4.57,42.67 4.57,42.06 IC8.7 | R25.2 11.43,45.87 12.5,44.81 12.5,43.59 11.43,42.52 11.43,38.86 | 11.43,38.86 11.73,38.56 12.5,38.56 | 12.5,38.56 13.26,39.32 R26.2 | 12.5,38.56 13.56,37.49 13.56,36.88 C2.2
N$40
  Top 0.152: 9.75,30.18 11.28,31.7 11.28,35.36 | 9.75,30.18 7.62,28.04 D1.C 7.47,27.89 4.72,25.15 4.72,19.51 2.59,17.37 2.59,8.99 F2.P$2 | 11.28,35.36 11.28,36.27 11.73,36.73 C2.1 11.89,36.73 12.8,35.81 14.48,35.81 14.63,35.97 14.63,36.12 | 14.63,36.12 14.63,39.32 13.87,40.08 12.8,40.08 12.19,39.47 R26.1 | 9.75,30.18 13.26,26.67 17.37,26.67 18.59,27.89 C8.1 | 14.63,36.12 17.37,33.38 18.29,33.38 C7.1 | 11.28,35.36 4.12,35.36 3.2,36.27 3.2,36.73 IC8.1
N$41
  Bottom 0.152: T12.1 22.86,50.44 23.77,50.44 25.3,51.97 R37.1
N$42
  Top 0.152: R21.2 13.26,28.04 13.26,28.65 12.5,29.41 H2.1
N$43
  Bottom 0.152: T15.1 16.92,45.72 16.61,45.72 R38.1
N$44
  Bottom 0.152: T14.1 22.86,41 25.15,41 25.3,41.15 R39.1
N$45
  Top 0.152: T5.1 113.08,37.03 113.84,37.03 115.52,35.36 122.99,35.36 123.75,36.12 123.75,36.73 IC7.4
N$46
  Bottom 0.152: T13.1 23.47,46.48 21.79,46.48 20.42,45.11 R40.1
N$47
  Top 0.152: T11.1 11.58,58.67 9.3,56.39 8.08,56.39 7.32,55.63 7.32,54.56 6.25,53.49 6.25,49.53 5.64,48.92 5.64,44.96 3.81,43.13 3.81,40.54 6.86,37.49 6.86,36.88 IC8.4
N$48
  Bottom 0.152: T14.3 21.95,42.98 21.95,44.2 22.1,44.35 R43.2
N$49
  Bottom 0.152: T12.3 21.95,52.58 23.47,54.1 R41.2
N$50
  Bottom 0.152: T15.3 19.96,41.6 19.2,41.6 18.29,42.52 16.61,42.52 R42.2
RHVTRIG  (via drill 0.38)
  Top 0.152: v15.54,27.43 15.09,27.89 14.63,27.89 R21.1 | v25.91,17.07 37.03,17.07 37.95,16.15 38.86,16.15 v39.93,17.22 | v54.25,19.81 57.76,19.81 v58.37,20.42 | v66.75,26.36 v64.16,23.77 | v68.58,26.98 69.04,26.98 69.19,27.13 70.41,27.13 IC5.3
  Bottom 0.152: v25.91,17.07 v15.54,27.43 | v39.93,17.22 40.84,17.22 41,17.07 43.28,17.07 46.02,19.81 v54.25,19.81 | v58.37,20.42 61.72,23.77 v64.16,23.77 | v66.75,26.36 67.97,26.36 v68.58,26.98
RTS+
  Bottom 0.152: X7.1 38.1,12.65 24.23,26.52 24.23,27.89 K2.O2
RTS-
  Top 0.152: X7.2 42.52,5.49 41,5.49 32.31,14.17 27.89,14.17 25.15,16.92 25.15,17.22 29.72,21.79 32.92,21.79 33.53,22.4 33.53,26.21 31.85,27.89 K2.O1
RVSEL
  Top 0.152: IC5.25 62.79,34.29 58.52,34.29 58.22,33.98 54.1,33.98 53.19,33.07 49.23,33.07 48.46,32.31 48.16,32.31 43.13,37.34 42.06,37.34 IC2.11
SCL  (via drill 0.38)
  Top 0.152: v69.34,34.14 69.65,33.83 70.41,33.83 IC5.13 | v56.84,30.33 53.19,26.67 48.77,26.67 v48.01,25.91 | v43.28,19.36 43.28,15.54 48.01,10.82 48.01,9.45 X8.2 48.16,9.3 48.16,7.92 50.44,5.64 57.61,5.64 58.22,5.03 v64.47,5.03 | v70.87,7.32 70.87,7.47 74.68,11.28 76.2,11.28 76.66,10.82 76.66,9.45 X9.2
  Bottom 0.152: v69.34,34.14 67.06,34.14 63.25,30.33 v56.84,30.33 | v48.01,25.91 47.55,25.91 47.09,26.36 46.79,26.36 46.18,25.76 46.18,22.25 v43.28,19.36 | v70.87,7.32 66.75,7.32 v64.47,5.03
SDA
  Top 0.152: 77.57,12.34 77.57,9.45 X9.3 | 77.57,12.34 77.57,31.85 76.5,32.92 70.56,32.92 IC5.12 | 77.57,12.34 61.87,12.34 61.42,12.8 49.99,12.8 48.92,11.73 48.92,9.45 X8.3
SPKR  (via drill 0.38)
  Top 0.152: v93.88,57.61 94.49,58.22 94.49,60.96 R14.1 | v70.41,40.08 69.65,39.32 69.49,39.32 67.21,37.03 67.21,35.36 70.1,32.46 70.41,32.46 IC5.11
  Bottom 0.152: v93.88,57.61 93.88,41.45 92.51,40.08 v70.41,40.08
TCK  (via drill 0.38)
  Top 0.152: v38.1,16.92 38.1,22.1 36.27,23.93 36.27,25.3 R32.1 | v59.74,9.14 62.48,6.4 C18.1 | v64.77,25.76 64.77,26.67 63.7,27.74 62.94,27.74 IC5.35 | v103.02,36.42 106.22,36.42 107.9,38.1 110.19,38.1 S5.2 | v8.84,62.33 11.43,64.92 26.52,64.92 35.2,56.24 35.2,40.54 35.36,40.39 62.18,40.39 66.75,35.81 66.75,30.33 66.6,30.18 66.6,28.96 v67.36,28.19
  Bottom 0.152: v38.1,16.92 38.56,16.92 41.45,14.02 45.41,14.02 49.53,9.91 58.98,9.91 v59.74,9.14 65.08,9.14 66.9,10.97 66.9,11.28 65.84,12.34 65.84,19.66 | 64.77,25.6 64.77,24.08 65.84,23.01 65.84,19.66 | v103.02,36.42 96.01,36.42 84.58,24.99 84.58,21.79 82.45,19.66 65.84,19.66 | v8.84,62.33 2.9,62.33 1.98,61.42 1.98,60.35 3.81,58.52 SV1.3 | 64.77,25.6 v67.36,28.19 | 64.77,25.6 v64.77,25.76
TDI  (via drill 0.38)
  Top 0.152: R34.1 5.64,55.78 5.64,55.17 SV1.5 3.05,52.58 2.9,52.58 1.68,51.36 1.68,41 2.9,39.78 2.9,38.71 1.22,37.03 1.22,7.92 4.72,4.42 21.79,4.42 26.52,9.14 31.85,9.14 37.95,3.05 43.28,3.05 44.81,1.52 63.4,1.52 63.55,1.68 63.55,3.5 63.7,3.66 67.51,3.66 | v64.01,26.52 62.94,26.52 IC5.37 | v56.08,23.01 51.82,23.01 S7.2 | v67.51,4.42 67.51,3.66 | 67.51,3.66 67.51,2.59 C20.1 | v66.29,5.94 66.29,10.06 64.31,12.04 v61.27,12.04
  Bottom 0.152: v64.01,26.52 62.64,26.52 59.13,23.01 56.84,23.01 | v56.08,23.01 56.84,23.01 | v67.51,4.42 67.51,4.72 v66.29,5.94 | v61.27,12.04 61.27,13.72 56.84,18.14 56.84,23.01
TDO  (via drill 0.38)
  Top 0.152: v86.87,18.44 89.46,21.03 89.46,21.49 R36.1 | v68.89,11.58 67.21,11.58 66.75,11.12 | 66.75,11.12 66.75,7.16 67.51,6.4 C21.1 | v60.5,25.76 62.79,25.76 IC5.38 | v30.79,18.44 36.12,18.44 36.73,19.05 S8.3 | v66.14,11.12 66.75,11.12
  Bottom 0.152: v86.87,18.44 76.2,18.44 69.34,11.58 v68.89,11.58 | v60.5,25.76 57.91,25.76 55.32,23.16 55.32,16 56.24,15.09 56.24,11.89 | 56.24,11.89 55.17,10.82 49.07,10.82 43.43,16.46 39.47,16.46 36.88,19.05 S8.3 | SV1.6 3.81,50.44 1.37,48.01 1.37,39.47 12.65,28.19 16.15,28.19 25.91,18.44 v30.79,18.44 | v66.14,11.12 57,11.12 56.24,11.89
TEST  (via drill 0.38)
  Top 0.152: 78.94,25.45 84.73,25.45 86.11,24.08 86.11,17.98 88.09,16 89.46,16 R20.1 | v78.33,26.06 78.94,25.45 | v72.39,27.13 71.17,25.91 70.56,25.91 IC5.1 | v10.21,58.67 v10.21,61.87 | v10.36,48.16 10.82,48.16 10.97,48.31 12.04,48.31 18.9,41.45 v18.9,40.39 | v19.36,38.56 19.36,37.95 v22.86,34.44 | v27.28,27.13 27.28,24.38 v26.36,23.47 | v40.23,12.95 v36.88,12.95 | v78.64,11.58 78.64,14.63 78.03,15.24 78.03,24.54 78.94,25.45
  Bottom 0.152: v78.33,26.06 73.46,26.06 v72.39,27.13 | v10.21,61.87 8.69,63.4 3.81,63.4 SV1.1 | v10.21,58.67 10.21,48.31 v10.36,48.16 | v18.9,40.39 18.9,39.93 19.36,39.47 v19.36,38.56 | v22.86,34.44 24.99,34.44 27.28,32.16 v27.28,27.13 | v26.36,23.47 26.67,23.47 36.88,13.26 v36.88,12.95 | v40.23,12.95 43.28,9.91 46.79,9.91 51.51,5.18 60.96,5.18 62.64,3.5 71.32,3.5 78.64,10.82 v78.64,11.58
TMS  (via drill 0.38)
  Top 0.152: R33.1 7.62,62.79 5.33,62.79 4.57,62.03 2.59,62.03 1.98,61.42 1.98,57.76 3.81,55.93 SV1.4 | v58.52,27.13 62.79,27.13 IC5.36 | v49.23,28.19 48.01,29.41 45.41,29.41 43.13,31.7 39.78,31.7 36.12,35.36 34.9,35.36 33.53,33.98 33.53,31.85 32.61,30.94 | 32.61,30.94 28.5,30.94 26.36,33.07 | 26.36,33.07 20.73,38.71 S6.2 | v53.95,2.44 62.48,2.44 C19.1 | v34.59,19.96 34.59,21.95 33.83,22.71 33.83,29.72 32.61,30.94 | v23.47,30.94 24.23,30.94 26.36,33.07
  Bottom 0.152: v58.52,27.13 50.29,27.13 v49.23,28.19 | v53.95,2.44 53.03,1.52 49.68,1.52 34.59,16.61 v34.59,19.96 | v23.47,30.94 23.01,30.48 20.27,30.48 11.89,38.86 11.89,40.54 6.1,46.33 6.1,53.49 3.81,55.78 SV1.4
VBAT  (via drill 0.38)
  Top 0.152: v97.69,43.59 96.01,41.91 R45.1 | v103.02,43.59 102.26,44.35 R46.2 | v64.47,32.46 62.94,32.46 IC5.28 | v85.8,30.18 v84.58,31.39
  Bottom 0.152: v103.02,43.59 100.13,43.59 | 100.13,43.59 v97.69,43.59 | v64.47,32.46 64.92,32.46 67.51,35.05 70.1,35.05 71.63,36.58 72.69,36.58 73.76,37.64 77.27,37.64 83.52,31.39 v84.58,31.39 | v85.8,30.18 86.11,30.18 96.16,40.23 99.52,40.23 100.13,40.84 100.13,43.59
VCC  (via drill 0.38)
  Top 0.152: 33.07,15.24 38.41,9.91 46.79,9.91 47.24,9.45 X8.1 47.4,9.3 47.4,7.92 50.14,5.18 57.61,5.18 58.52,4.27 v62.79,4.27 | v40.39,21.03 40.39,17.68 40.69,17.37 40.69,17.07 39.47,15.85 34.29,15.85 34.14,16 33.83,16 33.07,15.24 | 33.07,15.24 K2.1 | C10.1 95.71,64.77 96.77,65.84 104.24,65.84 107.9,62.18 L3.1 108.05,62.18 111.56,62.18 111.71,62.33 117.35,62.33 118.72,60.96 SG1.+ | v116.59,46.94 116.59,44.81 IC3.3 | v74.98,10.21 75.74,9.45 X9.1
  Bottom 0.152: v40.39,21.03 37.19,21.03 34.29,23.93 29.57,23.93 26.52,26.98 26.52,28.19 24.23,30.48 24.23,32.92 K2.S2 | SG1.+ 118.72,60.96 116.59,58.83 v116.59,46.94 106.68,37.03 106.68,36.88 103.94,34.14 96.32,34.14 95.25,33.07 K1.S2 95.25,32.92 93.42,31.09 93.42,22.4 99.06,16.76 | K1.1 100.58,15.24 99.06,16.76 | 99.06,16.76 96.47,14.17 92.05,14.17 90.22,12.34 78.49,12.34 76.35,10.21 v74.98,10.21 73.61,10.21 71.48,8.08 67.06,8.08 66.45,7.47 65.99,7.47 v62.79,4.27
XIN
  Top 0.152: IC5.6 70.56,29.11 72.69,29.11 73.61,30.02 Q3.2 73.76,30.18 73.91,30.33 73.91,31.7 C12.1
XOUT
  Top 0.152: IC5.5 70.56,28.5 73.61,28.5 Q3.1 73.76,28.35 74.98,27.13 76.2,27.13 C11.1
(copper drawn outside any net)
  shapes: Bottom area x5, Top area x5